# Altium project mcounter.PrjPcb
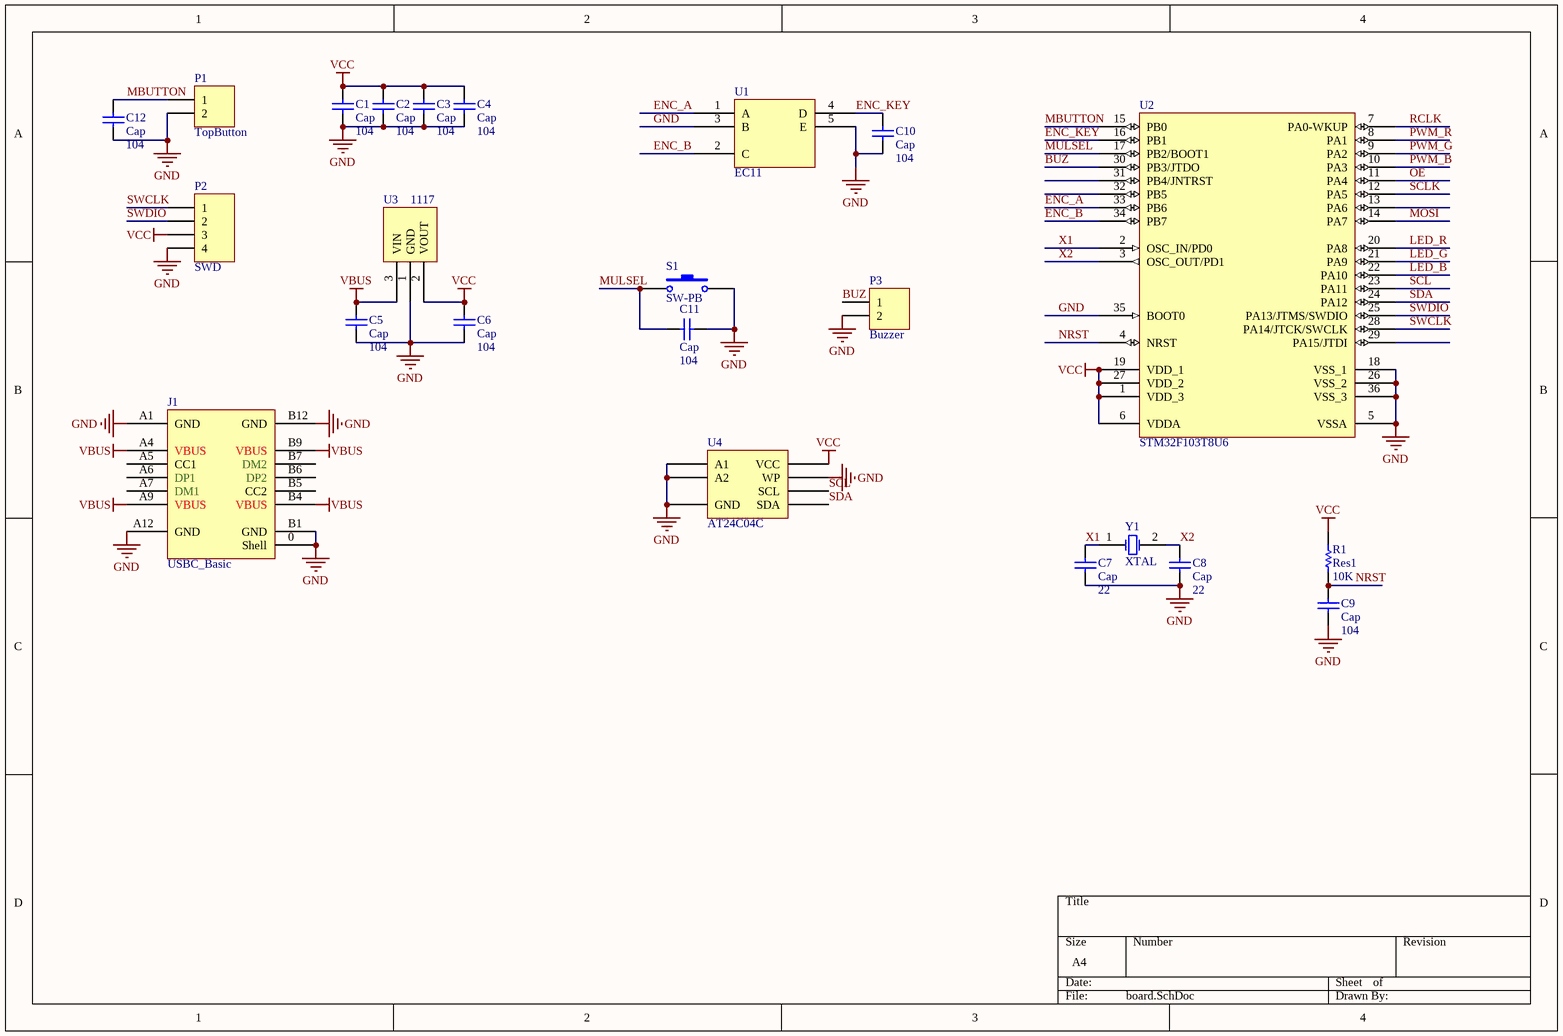
[diagram p0: board.SchDoc]
3 sheets, 91 parts. Net scope: global (net labels, ports and power ports of the same name join across sheets).
Board file: board.PcbDoc
Sheets:
  board.SchDoc
  ringled.SchDoc
  progressled.SchDoc

## Sheet board.SchDoc
size A4

### Parts
C1  Cap  value 104  [0805]
C2  Cap  value 104  [0805]
C3  Cap  value 104  [0805]
C4  Cap  value 104  [0805]
C5  Cap  value 104  [0805]
C6  Cap  value 104  [0805]
C7  Cap  value 22  [0805]
C8  Cap  value 22  [0805]
C9  Cap  value 104  [0805]
C10  Cap  value 104  [0805]
C11  Cap  value 104  [0805]
C12  Cap  value 104  [0805]
J1  USBC_Basic  [USBC_BS]
P1  TopButton  [HDR1X2]
P2  SWD  [HDR1X4]
P3  Buzzer  [BUZZER_SMT]
R1  Res1  value 10K  [0805]
S1  SW-PB  [SW_PB_665]
U1  EC11  [EC11]
U2  STM32F103T8U6  [QFN36]
U3  1117  [SOT-223]
U4  AT24C04C  [SO-08]
Y1  XTAL  [XTAL-5]

### Nets
GND: C1.1 C2.1 C3.1 C4.1 C5.1 C6.1 C7.1 C8.1 C9.1 C10.1 C11.1 C12.1 J1.0(Shell) J1.A1(GND) J1.A12(GND) J1.B1(GND) J1.B12(GND) P1.2 P2.4 P3.2 S1.2 U1.3(B) U1.5(E) U2.5(VSSA) U2.18(VSS_1) U2.26(VSS_2) U2.35(BOOT0) U2.36(VSS_3) U3.1(GND) U4.2(A1) U4.3(A2) U4.4(GND) U4.7(WP)
VBUS: C5.2 J1.A4(VBUS) J1.A9(VBUS) J1.B4(VBUS) J1.B9(VBUS) U3.3(VIN)
VCC: C1.2 C2.2 C3.2 C4.2 C6.2 P2.3 R1.2 U2.1(VDD_3) U2.6(VDDA) U2.19(VDD_1) U2.27(VDD_2) U3.2(VOUT) U4.8(VCC)
BUZ: P3.1 U2.30(PB3/JTDO)
ENC_A: U1.1(A) U2.33(PB6)
ENC_B: U1.2(C) U2.34(PB7)
ENC_KEY: C10.2 U1.4(D) U2.16(PB1)
LED_B: U2.22(PA10)
LED_G: U2.21(PA9)
LED_R: U2.20(PA8)
MBUTTON: C12.2 P1.1 U2.15(PB0)
MOSI: U2.14(PA7)
MULSEL: C11.2 S1.1 U2.17(PB2/BOOT1)
NRST: C9.2 R1.1 U2.4(NRST)
OE: U2.11(PA4)
PWM_B: U2.10(PA3)
PWM_G: U2.9(PA2)
PWM_R: U2.8(PA1)
RCLK: U2.7(PA0-WKUP)
SCL: U2.23(PA11) U4.6(SCL)
SCLK: U2.12(PA5)
SDA: U2.24(PA12) U4.5(SDA)
SWCLK: P2.1 U2.28(PA14/JTCK/SWCLK)
SWDIO: P2.2 U2.25(PA13/JTMS/SWDIO)
X1: C7.2 U2.2(OSC_IN/PD0) Y1.1(OSC1)
X2: C8.2 U2.3(OSC_OUT/PD1) Y1.2(OSC2)

Not connected (* = marked no-connect by the designer): J1 A5(CC1) A6(DP1) A7(DM1) B5(CC2) B6(DP2) B7(DM2); U2 13(PA6) 29(PA15/JTDI) 31(PB4/JNTRST) 32(PB5)

### Library data of the parts
C1-C12 = Cap: Capacitor; Published: 8-Jun-2000; LatestRevisionDate: 17-Jul-2002; LatestRevisionNote: Re-released for DXP Platform.; PackageReference: RAD-0.3; Publisher: Altium Limited; PackageDescription: Radial Cap, Thru-Hole; 2 Leads; 0.3 in Pin Spacing
J1 = USB-C_BASIC
P1 P3 = Header 2: Header, 2-Pin; LatestRevisionDate: 17-Jul-2002; LatestRevisionNote: Re-released for DXP Platform.; Publisher: Altium Limited
P2 = Header 4: Header, 4-Pin; LatestRevisionDate: 17-Jul-2002; LatestRevisionNote: Re-released for DXP Platform.; Publisher: Altium Limited
R1 = Res1: Resistor; Published: 8-Jun-2000; LatestRevisionDate: 17-Jul-2002; LatestRevisionNote: Re-released for DXP Platform.; PackageReference: AXIAL-0.3; Publisher: Altium Limited; PackageDescription: Axial Device, Thru-Hole; 2 Leads; 0.3 in Pin Spacing
S1 = SW-PB: Switch; Published: 24-Mar-1999; LatestRevisionDate: 17-Jul-2002; LatestRevisionNote: Re-released for DXP Platform.; PackageReference: SPST-2; Publisher: Altium Limited; PackageDescription: Switch; 2 Leads
U1 = EC11: Encoder with SW-PB
U2 = STM32F103T8U6: STM32 ARM-based 32-bit MCU with 64 Kbytes Flash, 36-pin VFQFPN, Industrial Temperature; Published: *; DatasheetVersion: *; PackageVersion: *; PackageReference: *; Publisher: *; PackageDescription: *; ComponentLink1Description: *; ComponentLink1URL: *; ComponentLink2Description: *; ComponentLink2URL: *
U3 = 1117_3.3: 5V-3.3V Voltage Regulator
Y1 = XTAL: Crystal Oscillator; Published: 8-Jun-2000; LatestRevisionDate: 17-Jul-2002; LatestRevisionNote: Re-released for DXP Platform.; PackageReference: R38; Publisher: Altium Limited; PackageDescription: Crystal, Thru-Hole; 2 Leads; Body 3.1 x 8.2 mm (Dia.xH)

## Sheet ringled.SchDoc
size A4
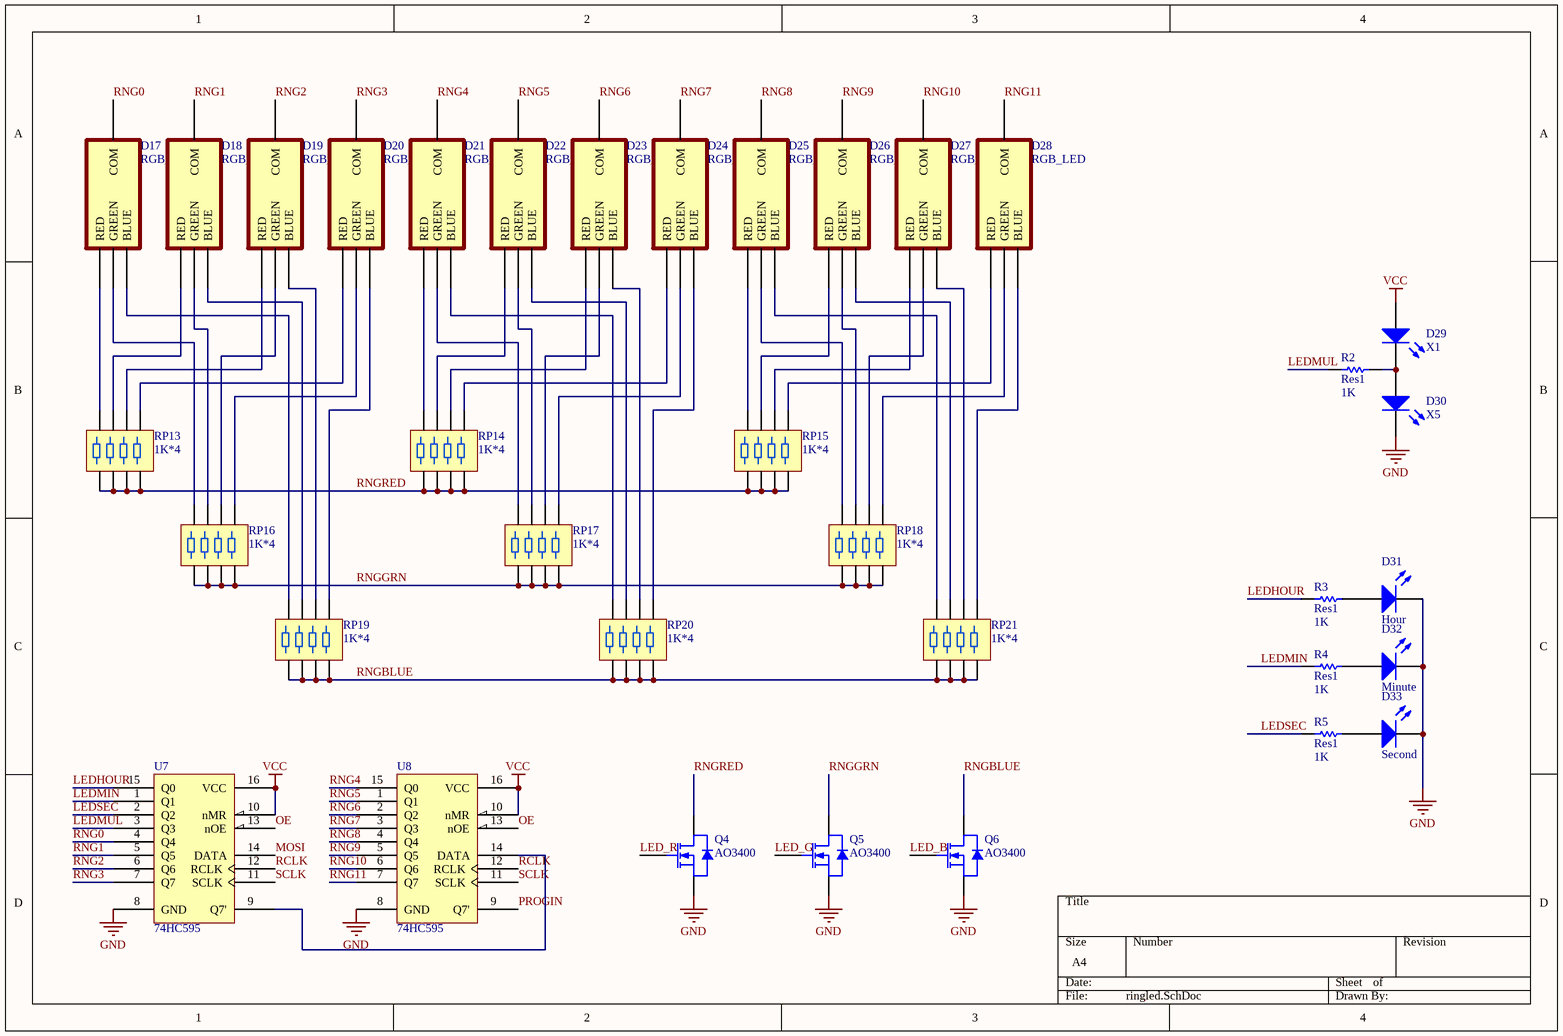
[diagram p1: ringled.SchDoc]

### Parts
D17  RGB_LED  [0805_RGB]
D18  RGB_LED  [0805_RGB]
D19  RGB_LED  [0805_RGB]
D20  RGB_LED  [0805_RGB]
D21  RGB_LED  [0805_RGB]
D22  RGB_LED  [0805_RGB]
D23  RGB_LED  [0805_RGB]
D24  RGB_LED  [0805_RGB]
D25  RGB_LED  [0805_RGB]
D26  RGB_LED  [0805_RGB]
D27  RGB_LED  [0805_RGB]
D28  RGB_LED  [0805_RGB]
D29  X1  [0805_LED]
D30  X5  [0805_LED]
D31  Hour  [0805_LED]
D32  Minute  [0805_LED]
D33  Second  [0805_LED]
Q4  AO3400  [SOT-23]
Q5  AO3400  [SOT-23]
Q6  AO3400  [SOT-23]
R2  Res1  value 1K  [0805]
R3  Res1  value 1K  [0805]
R4  Res1  value 1K  [0805]
R5  Res1  value 1K  [0805]
RP13  1K*4  [0603X4]
RP14  1K*4  [0603X4]
RP15  1K*4  [0603X4]
RP16  1K*4  [0603X4]
RP17  1K*4  [0603X4]
RP18  1K*4  [0603X4]
RP19  1K*4  [0603X4]
RP20  1K*4  [0603X4]
RP21  1K*4  [0603X4]
U7  74HC595  [TSSOP16]
U8  74HC595  [TSSOP16]

### Nets
GND: D30.2(K) D31.2(K) D32.2(K) D33.2(K) Q4.2(S) Q5.2(S) Q6.2(S) U7.8(GND) U8.8(GND)
VCC: D29.1(A) U7.10(nMR) U7.16(VCC) U8.10(nMR) U8.16(VCC)
LED_B: Q6.1(G)
LED_G: Q5.1(G)
LED_R: Q4.1(G)
LEDHOUR: R3.1 U7.15(Q0)
LEDMIN: R4.1 U7.1(Q1)
LEDMUL: R2.1 U7.3(Q3)
LEDSEC: R5.1 U7.2(Q2)
MOSI: U7.14(DATA)
OE: U7.13(nOE) U8.13(nOE)
PROGIN: U8.9(Q7')
RCLK: U7.12(RCLK) U8.12(RCLK)
RNG0: D17.COM U7.4(Q4)
RNG1: D18.COM U7.5(Q5)
RNG2: D19.COM U7.6(Q6)
RNG3: D20.COM U7.7(Q7)
RNG4: D21.COM U8.15(Q0)
RNG5: D22.COM U8.1(Q1)
RNG6: D23.COM U8.2(Q2)
RNG7: D24.COM U8.3(Q3)
RNG8: D25.COM U8.4(Q4)
RNG9: D26.COM U8.5(Q5)
RNG10: D27.COM U8.6(Q6)
RNG11: D28.COM U8.7(Q7)
RNGBLUE: Q6.3(D) RP19.1 RP19.2 RP19.3 RP19.4 RP20.1 RP20.2 RP20.3 RP20.4 RP21.1 RP21.2 RP21.3 RP21.4
RNGGRN: Q5.3(D) RP16.1 RP16.2 RP16.3 RP16.4 RP17.1 RP17.2 RP17.3 RP17.4 RP18.1 RP18.2 RP18.3 RP18.4
RNGRED: Q4.3(D) RP13.1 RP13.2 RP13.3 RP13.4 RP14.1 RP14.2 RP14.3 RP14.4 RP15.1 RP15.2 RP15.3 RP15.4
SCLK: U7.11(SCLK) U8.11(SCLK)
NetD17_B: D17.B(BLUE) RP19.8
NetD17_G: D17.G(GREEN) RP16.8
NetD17_R: D17.R(RED) RP13.8
NetD18_B: D18.B(BLUE) RP19.7
NetD18_G: D18.G(GREEN) RP16.7
NetD18_R: D18.R(RED) RP13.7
NetD19_B: D19.B(BLUE) RP19.6
NetD19_G: D19.G(GREEN) RP16.6
NetD19_R: D19.R(RED) RP13.6
NetD20_B: D20.B(BLUE) RP19.5
NetD20_G: D20.G(GREEN) RP16.5
NetD20_R: D20.R(RED) RP13.5
NetD21_B: D21.B(BLUE) RP20.8
NetD21_G: D21.G(GREEN) RP17.8
NetD21_R: D21.R(RED) RP14.8
NetD22_B: D22.B(BLUE) RP20.7
NetD22_G: D22.G(GREEN) RP17.7
NetD22_R: D22.R(RED) RP14.7
NetD23_B: D23.B(BLUE) RP20.6
NetD23_G: D23.G(GREEN) RP17.6
NetD23_R: D23.R(RED) RP14.6
NetD24_B: D24.B(BLUE) RP20.5
NetD24_G: D24.G(GREEN) RP17.5
NetD24_R: D24.R(RED) RP14.5
NetD25_B: D25.B(BLUE) RP21.8
NetD25_G: D25.G(GREEN) RP18.8
NetD25_R: D25.R(RED) RP15.8
NetD26_B: D26.B(BLUE) RP21.7
NetD26_G: D26.G(GREEN) RP18.7
NetD26_R: D26.R(RED) RP15.7
NetD27_B: D27.B(BLUE) RP21.6
NetD27_G: D27.G(GREEN) RP18.6
NetD27_R: D27.R(RED) RP15.6
NetD28_B: D28.B(BLUE) RP21.5
NetD28_G: D28.G(GREEN) RP18.5
NetD28_R: D28.R(RED) RP15.5
NetD29_2: D29.2(K) D30.1(A) R2.2
NetD31_1: D31.1(A) R3.2
NetD32_1: D32.1(A) R4.2
NetD33_1: D33.1(A) R5.2
NetU7_9: U7.9(Q7') U8.14(DATA)

### Library data of the parts
D17-D28 = RGBLED
D29-D33 = LED0: Typical INFRARED GaAs LED; Published: 8-Jun-2000; LatestRevisionDate: 08-Jul-2005; LatestRevisionNote: Mech Layer 1 removed.; PackageReference: LED-0; Publisher: Altium Limited; PackageDescription: LED; 2 Leads
Q4-Q6 = AO3400: N-Channel MOSFET; Published: 8-Jun-2000; Revision: July-2002: Re-released for DXP Platform.; Publisher: Altium Limited
R2-R5 = Res1: Resistor; Published: 8-Jun-2000; LatestRevisionDate: 17-Jul-2002; LatestRevisionNote: Re-released for DXP Platform.; PackageReference: AXIAL-0.3; Publisher: Altium Limited; PackageDescription: Axial Device, Thru-Hole; 2 Leads; 0.3 in Pin Spacing
RP13-RP21 = RPack_4
U7 U8 = 74HC595: 8-bit serial-in, serial or parallel-out shift register with output latches; 3-state

## Sheet progressled.SchDoc
size A4
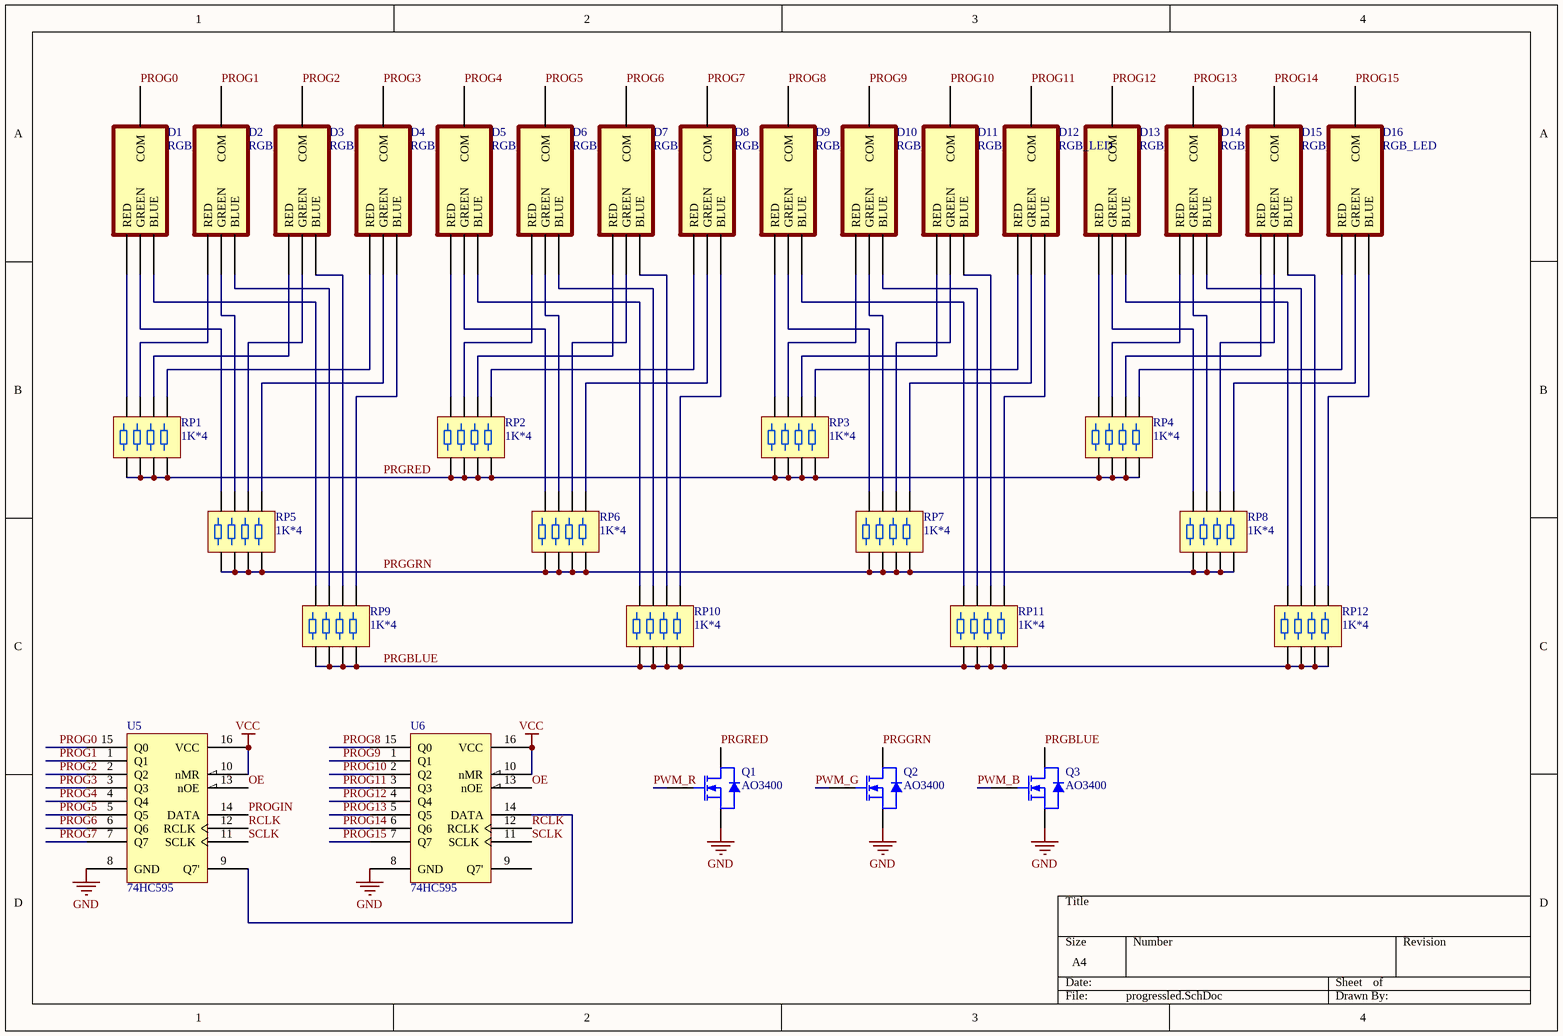
[diagram p2: progressled.SchDoc]

### Parts
D1  RGB_LED  [0805_RGB]
D2  RGB_LED  [0805_RGB]
D3  RGB_LED  [0805_RGB]
D4  RGB_LED  [0805_RGB]
D5  RGB_LED  [0805_RGB]
D6  RGB_LED  [0805_RGB]
D7  RGB_LED  [0805_RGB]
D8  RGB_LED  [0805_RGB]
D9  RGB_LED  [0805_RGB]
D10  RGB_LED  [0805_RGB]
D11  RGB_LED  [0805_RGB]
D12  RGB_LED  [0805_RGB]
D13  RGB_LED  [0805_RGB]
D14  RGB_LED  [0805_RGB]
D15  RGB_LED  [0805_RGB]
D16  RGB_LED  [0805_RGB]
Q1  AO3400  [SOT-23]
Q2  AO3400  [SOT-23]
Q3  AO3400  [SOT-23]
RP1  1K*4  [0603x4]
RP2  1K*4  [0603x4]
RP3  1K*4  [0603x4]
RP4  1K*4  [0603x4]
RP5  1K*4  [0603x4]
RP6  1K*4  [0603x4]
RP7  1K*4  [0603x4]
RP8  1K*4  [0603x4]
RP9  1K*4  [0603x4]
RP10  1K*4  [0603x4]
RP11  1K*4  [0603x4]
RP12  1K*4  [0603x4]
U5  74HC595  [TSSOP16]
U6  74HC595  [TSSOP16]

### Nets
GND: Q1.2(S) Q2.2(S) Q3.2(S) U5.8(GND) U6.8(GND)
VCC: U5.10(nMR) U5.16(VCC) U6.10(nMR) U6.16(VCC)
OE: U5.13(nOE) U6.13(nOE)
PRGBLUE: Q3.3(D) RP9.1 RP9.2 RP9.3 RP9.4 RP10.1 RP10.2 RP10.3 RP10.4 RP11.1 RP11.2 RP11.3 RP11.4 RP12.1 RP12.2 RP12.3 RP12.4
PRGGRN: Q2.3(D) RP5.1 RP5.2 RP5.3 RP5.4 RP6.1 RP6.2 RP6.3 RP6.4 RP7.1 RP7.2 RP7.3 RP7.4 RP8.1 RP8.2 RP8.3 RP8.4
PRGRED: Q1.3(D) RP1.1 RP1.2 RP1.3 RP1.4 RP2.1 RP2.2 RP2.3 RP2.4 RP3.1 RP3.2 RP3.3 RP3.4 RP4.1 RP4.2 RP4.3 RP4.4
PROG0: D1.COM U5.15(Q0)
PROG1: D2.COM U5.1(Q1)
PROG2: D3.COM U5.2(Q2)
PROG3: D4.COM U5.3(Q3)
PROG4: D5.COM U5.4(Q4)
PROG5: D6.COM U5.5(Q5)
PROG6: D7.COM U5.6(Q6)
PROG7: D8.COM U5.7(Q7)
PROG8: D9.COM U6.15(Q0)
PROG9: D10.COM U6.1(Q1)
PROG10: D11.COM U6.2(Q2)
PROG11: D12.COM U6.3(Q3)
PROG12: D13.COM U6.4(Q4)
PROG13: D14.COM U6.5(Q5)
PROG14: D15.COM U6.6(Q6)
PROG15: D16.COM U6.7(Q7)
PROGIN: U5.14(DATA)
PWM_B: Q3.1(G)
PWM_G: Q2.1(G)
PWM_R: Q1.1(G)
RCLK: U5.12(RCLK) U6.12(RCLK)
SCLK: U5.11(SCLK) U6.11(SCLK)
NetD1_B: D1.B(BLUE) RP9.8
NetD1_G: D1.G(GREEN) RP5.8
NetD1_R: D1.R(RED) RP1.8
NetD2_B: D2.B(BLUE) RP9.7
NetD2_G: D2.G(GREEN) RP5.7
NetD2_R: D2.R(RED) RP1.7
NetD3_B: D3.B(BLUE) RP9.6
NetD3_G: D3.G(GREEN) RP5.6
NetD3_R: D3.R(RED) RP1.6
NetD4_B: D4.B(BLUE) RP9.5
NetD4_G: D4.G(GREEN) RP5.5
NetD4_R: D4.R(RED) RP1.5
NetD5_B: D5.B(BLUE) RP10.8
NetD5_G: D5.G(GREEN) RP6.8
NetD5_R: D5.R(RED) RP2.8
NetD6_B: D6.B(BLUE) RP10.7
NetD6_G: D6.G(GREEN) RP6.7
NetD6_R: D6.R(RED) RP2.7
NetD7_B: D7.B(BLUE) RP10.6
NetD7_G: D7.G(GREEN) RP6.6
NetD7_R: D7.R(RED) RP2.6
NetD8_B: D8.B(BLUE) RP10.5
NetD8_G: D8.G(GREEN) RP6.5
NetD8_R: D8.R(RED) RP2.5
NetD9_B: D9.B(BLUE) RP11.8
NetD9_G: D9.G(GREEN) RP7.8
NetD9_R: D9.R(RED) RP3.8
NetD10_B: D10.B(BLUE) RP11.7
NetD10_G: D10.G(GREEN) RP7.7
NetD10_R: D10.R(RED) RP3.7
NetD11_B: D11.B(BLUE) RP11.6
NetD11_G: D11.G(GREEN) RP7.6
NetD11_R: D11.R(RED) RP3.6
NetD12_B: D12.B(BLUE) RP11.5
NetD12_G: D12.G(GREEN) RP7.5
NetD12_R: D12.R(RED) RP3.5
NetD13_B: D13.B(BLUE) RP12.8
NetD13_G: D13.G(GREEN) RP8.8
NetD13_R: D13.R(RED) RP4.8
NetD14_B: D14.B(BLUE) RP12.7
NetD14_G: D14.G(GREEN) RP8.7
NetD14_R: D14.R(RED) RP4.7
NetD15_B: D15.B(BLUE) RP12.6
NetD15_G: D15.G(GREEN) RP8.6
NetD15_R: D15.R(RED) RP4.6
NetD16_B: D16.B(BLUE) RP12.5
NetD16_G: D16.G(GREEN) RP8.5
NetD16_R: D16.R(RED) RP4.5
NetU5_9: U5.9(Q7') U6.14(DATA)

Not connected (* = marked no-connect by the designer): U6 9(Q7')

### Library data of the parts
D1-D16 = RGBLED
Q1-Q3 = AO3400: N-Channel MOSFET; Published: 8-Jun-2000; Revision: July-2002: Re-released for DXP Platform.; Publisher: Altium Limited
RP1-RP12 = RPack_4
U5 U6 = 74HC595: as U7 on sheet ringled

## Nets that join several sheets
GND: board (33 pins), ringled (9 pins), progressled (5 pins)
VCC: board (13 pins), ringled (5 pins), progressled (U5.10 U5.16 U6.10 U6.16)
LED_B: board (U2.22), ringled (Q6.1)
LED_G: board (U2.21), ringled (Q5.1)
LED_R: board (U2.20), ringled (Q4.1)
MOSI: board (U2.14), ringled (U7.14)
OE: board (U2.11), ringled (U7.13 U8.13), progressled (U5.13 U6.13)
PROGIN: ringled (U8.9), progressled (U5.14)
PWM_B: board (U2.10), progressled (Q3.1)
PWM_G: board (U2.9), progressled (Q2.1)
PWM_R: board (U2.8), progressled (Q1.1)
RCLK: board (U2.7), ringled (U7.12 U8.12), progressled (U5.12 U6.12)
SCLK: board (U2.12), ringled (U7.11 U8.11), progressled (U5.11 U6.11)